# EAGLE schematic emojinecklace (EAGLE 7.5.0)
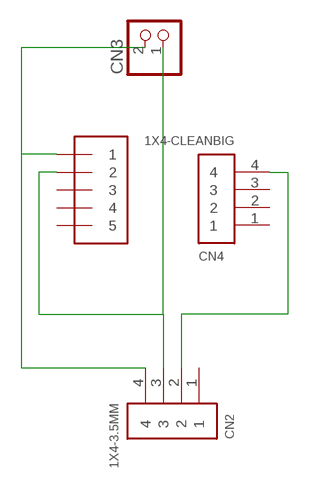
[diagram p0: schematic, sheet 1]

## Parts
CN2  1X4-3.5MM  [1X04-3.5MM]
CN3  JST_2PIN-THM  [JST-PH-2-THM]
CN4  1X4-CLEANBIG  [1X04-CLEANBIG]
J1  1X5  [1X05-3.5MM]

## Nets
B0: CN2.2 CN4.4
N$2: CN2.4 CN3.2 J1.1
N$3: CN2.3 CN3.1 J1.2
Unconnected: CN2.1 CN4.1 CN4.2 CN4.3 J1.3 J1.4 J1.5

## Library data of the parts
CN2 CN4 = adafruit:1X4: 4-pin connector
CN3 = adafruit:JST_2PIN: JST 2-Pin Connectors of various flavors SMT-RA (S2B-PH-SM4) 4UConnector #17311 SMT (B2B-PH-SM4) THM-RA (S2B-PH) THM (B2B-PH)
J1 = adafruit:1X5